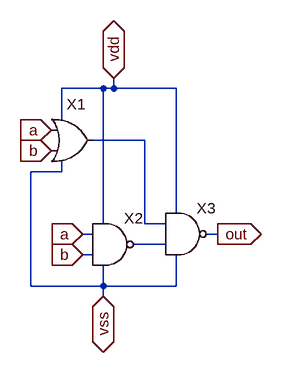
[diagram p0: schematic xnor.asc]
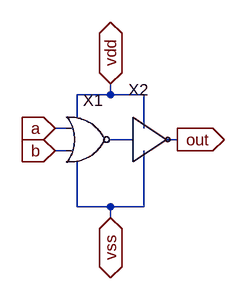
[diagram p1: sub-circuit or.asc]
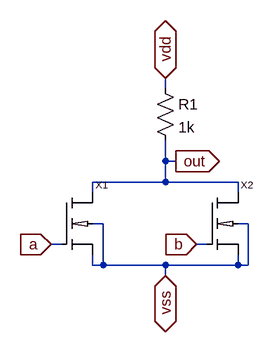
[diagram p2: sub-circuit nor.asc]
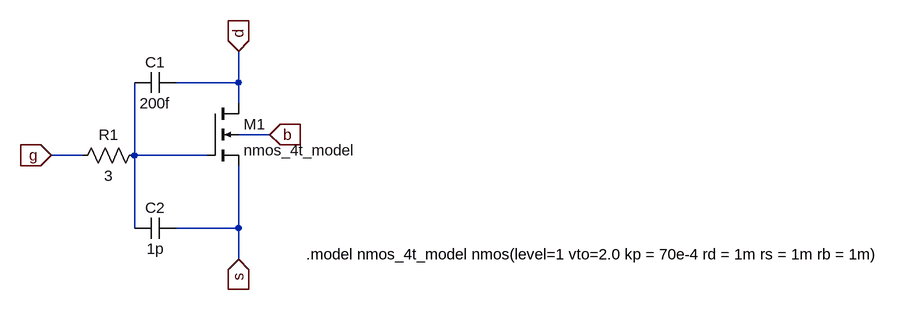
[diagram p3: sub-circuit nmos_4t.asc]
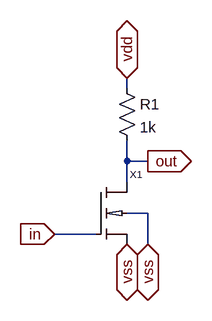
[diagram p4: sub-circuit not.asc]
xnor.asc, the LTspice schematic file:
Version 4
SHEET 1 880 680
WIRE 208 -144 144 -144
WIRE 224 -144 224 -160
WIRE 224 -144 208 -144
WIRE 320 -144 224 -144
WIRE 144 -96 144 -144
WIRE 272 -64 192 -64
WIRE 144 -16 144 -32
WIRE 144 -16 96 -16
WIRE 320 48 320 -144
WIRE 208 64 208 -144
WIRE 272 64 272 -64
WIRE 304 64 272 64
WIRE 192 80 176 80
WIRE 384 80 368 80
WIRE 304 96 256 96
WIRE 192 112 176 112
WIRE 96 160 96 -16
WIRE 208 160 208 128
WIRE 208 160 96 160
WIRE 320 160 320 112
WIRE 320 160 208 160
WIRE 208 176 208 160
FLAG 128 -80 a
IOPIN 128 -80 In
FLAG 176 80 a
IOPIN 176 80 In
FLAG 176 112 b
IOPIN 176 112 In
FLAG 128 -48 b
IOPIN 128 -48 In
FLAG 384 80 out
IOPIN 384 80 Out
FLAG 224 -160 vdd
IOPIN 224 -160 BiDir
FLAG 208 176 vss
IOPIN 208 176 BiDir
SYMBOL nand 224 32 R0
SYMATTR InstName X2
SYMBOL or 160 -128 R0
SYMATTR InstName X1
SYMBOL nand 336 16 R0
SYMATTR InstName X3

or.asc, the sub-circuit schematic file:
Version 4
SHEET 1 880 680
WIRE 176 80 176 64
WIRE 176 80 128 80
WIRE 224 80 176 80
WIRE 128 112 128 80
WIRE 112 128 96 128
WIRE 224 128 224 80
WIRE 208 144 176 144
WIRE 272 144 256 144
WIRE 112 160 96 160
WIRE 128 240 128 176
WIRE 176 240 128 240
WIRE 224 240 224 160
WIRE 224 240 176 240
WIRE 176 256 176 240
FLAG 272 144 out
IOPIN 272 144 Out
FLAG 176 64 vdd
IOPIN 176 64 BiDir
FLAG 176 256 vss
IOPIN 176 256 BiDir
FLAG 96 128 a
IOPIN 96 128 In
FLAG 96 160 b
IOPIN 96 160 In
SYMBOL nor 144 80 R0
SYMATTR InstName X1
SYMBOL not 208 144 R0
SYMATTR InstName X2
SYMATTR Value ""

nor.asc, the sub-circuit schematic file:
Version 4
SHEET 1 880 680
WIRE 240 48 240 32
WIRE 240 160 240 128
WIRE 256 160 240 160
WIRE 240 192 240 160
WIRE 240 192 128 192
WIRE 352 192 240 192
WIRE 128 208 128 192
WIRE 352 208 352 192
WIRE 144 256 128 256
WIRE 368 256 352 256
WIRE 80 288 64 288
WIRE 304 288 288 288
WIRE 128 320 128 304
WIRE 144 320 144 256
WIRE 144 320 128 320
WIRE 240 320 144 320
WIRE 352 320 352 304
WIRE 352 320 240 320
WIRE 368 320 368 256
WIRE 368 320 352 320
WIRE 240 336 240 320
FLAG 240 32 vdd
IOPIN 240 32 BiDir
FLAG 240 336 vss
IOPIN 240 336 BiDir
FLAG 256 160 out
IOPIN 256 160 Out
FLAG 288 288 b
IOPIN 288 288 In
FLAG 64 288 a
IOPIN 64 288 In
SYMBOL res 224 32 R0
SYMATTR InstName R1
SYMATTR Value 1k
SYMBOL nmos_4t 80 208 R0
SYMATTR InstName X1
SYMBOL nmos_4t 304 208 R0
SYMATTR InstName X2

nmos_4t.asc, the sub-circuit schematic file:
Version 4
SHEET 1 880 680
WIRE -288 -224 -288 -272
WIRE -288 -224 -384 -224
WIRE -288 -192 -288 -224
WIRE -240 -144 -288 -144
WIRE -528 -112 -576 -112
WIRE -448 -112 -448 -224
WIRE -336 -112 -448 -112
WIRE -448 0 -448 -112
WIRE -288 0 -288 -96
WIRE -288 0 -384 0
WIRE -288 48 -288 0
FLAG -576 -112 g
IOPIN -576 -112 In
FLAG -288 -272 d
IOPIN -288 -272 In
FLAG -288 48 s
IOPIN -288 48 In
FLAG -240 -144 b
IOPIN -240 -144 In
SYMBOL nmos4 -336 -192 R0
SYMATTR InstName M1
SYMATTR Value nmos_4t_model
SYMBOL cap -384 -240 R90
WINDOW 0 0 32 VBottom 2
WINDOW 3 32 32 VTop 2
SYMATTR InstName C1
SYMATTR Value 200f
SYMBOL cap -384 -16 R90
WINDOW 0 0 32 VBottom 2
WINDOW 3 32 32 VTop 2
SYMATTR InstName C2
SYMATTR Value 1p
SYMBOL res -432 -128 R90
WINDOW 0 0 56 VBottom 2
WINDOW 3 32 56 VTop 2
SYMATTR InstName R1
SYMATTR Value 3
TEXT -184 40 Left 2 !.model nmos_4t_model nmos(level=1 vto=2.0 kp = 70e-4 rd = 1m rs = 1m rb = 1m)

not.asc, the sub-circuit schematic file:
Version 4
SHEET 1 880 680
WIRE 176 -96 176 -112
WIRE 176 16 176 -16
WIRE 208 16 176 16
WIRE 176 48 176 16
WIRE 208 96 176 96
WIRE 128 128 64 128
WIRE 208 144 208 96
FLAG 64 128 in
IOPIN 64 128 In
FLAG 176 144 vss
IOPIN 176 144 BiDir
FLAG 176 -112 vdd
IOPIN 176 -112 BiDir
FLAG 208 16 out
IOPIN 208 16 Out
FLAG 208 144 vss
IOPIN 208 144 BiDir
SYMBOL res 160 -112 R0
SYMATTR InstName R1
SYMATTR Value 1k
SYMBOL nmos_4t 128 48 R0
SYMATTR InstName X1

The netlist it stands for:
* xnor.asc
XX2 a b vdd vss N002 nand  ; pins a b vdd vss out
XX1 a b N001 vdd vss or
XX3 N001 N002 vdd vss out nand  ; pins a b vdd vss out

* block symbol definitions
.subckt or a b out vdd vss
XX1 a b vdd vss N001 nor
XX2 N001 out vss vdd not
.ends or

.subckt nor a b vdd vss out
R1 vdd out 1k
XX1 out a vss vss nmos_4t
XX2 out b vss vss nmos_4t
.ends nor

.subckt nmos_4t D G S B
M1 d N001 s b nmos_4t_model
C1 d N001 200f
C2 s N001 1p
R1 N001 g 3
.model nmos_4t_model nmos(level=1 vto=2.0 kp = 70e-4 rd = 1m rs = 1m rb = 1m)
.ends nmos_4t

.subckt not in out vss vdd
R1 vdd out 1k
XX1 out in vss vss nmos_4t
.ends not

.model NMOS NMOS
.model PMOS PMOS
.lib standard.mos
.backanno
.end